# EasyEDA Pro project 电流采样.eprj

# Schematic Schematic1
Board Name: Board1; Create Date: 2025-05-20; Page Name: P1; Project Name: 霍尔; Schematic Name: Schematic1; Update Date: 2025-06-05; Company: 嘉立创EDA; Page Size: A4; Version: V1.0
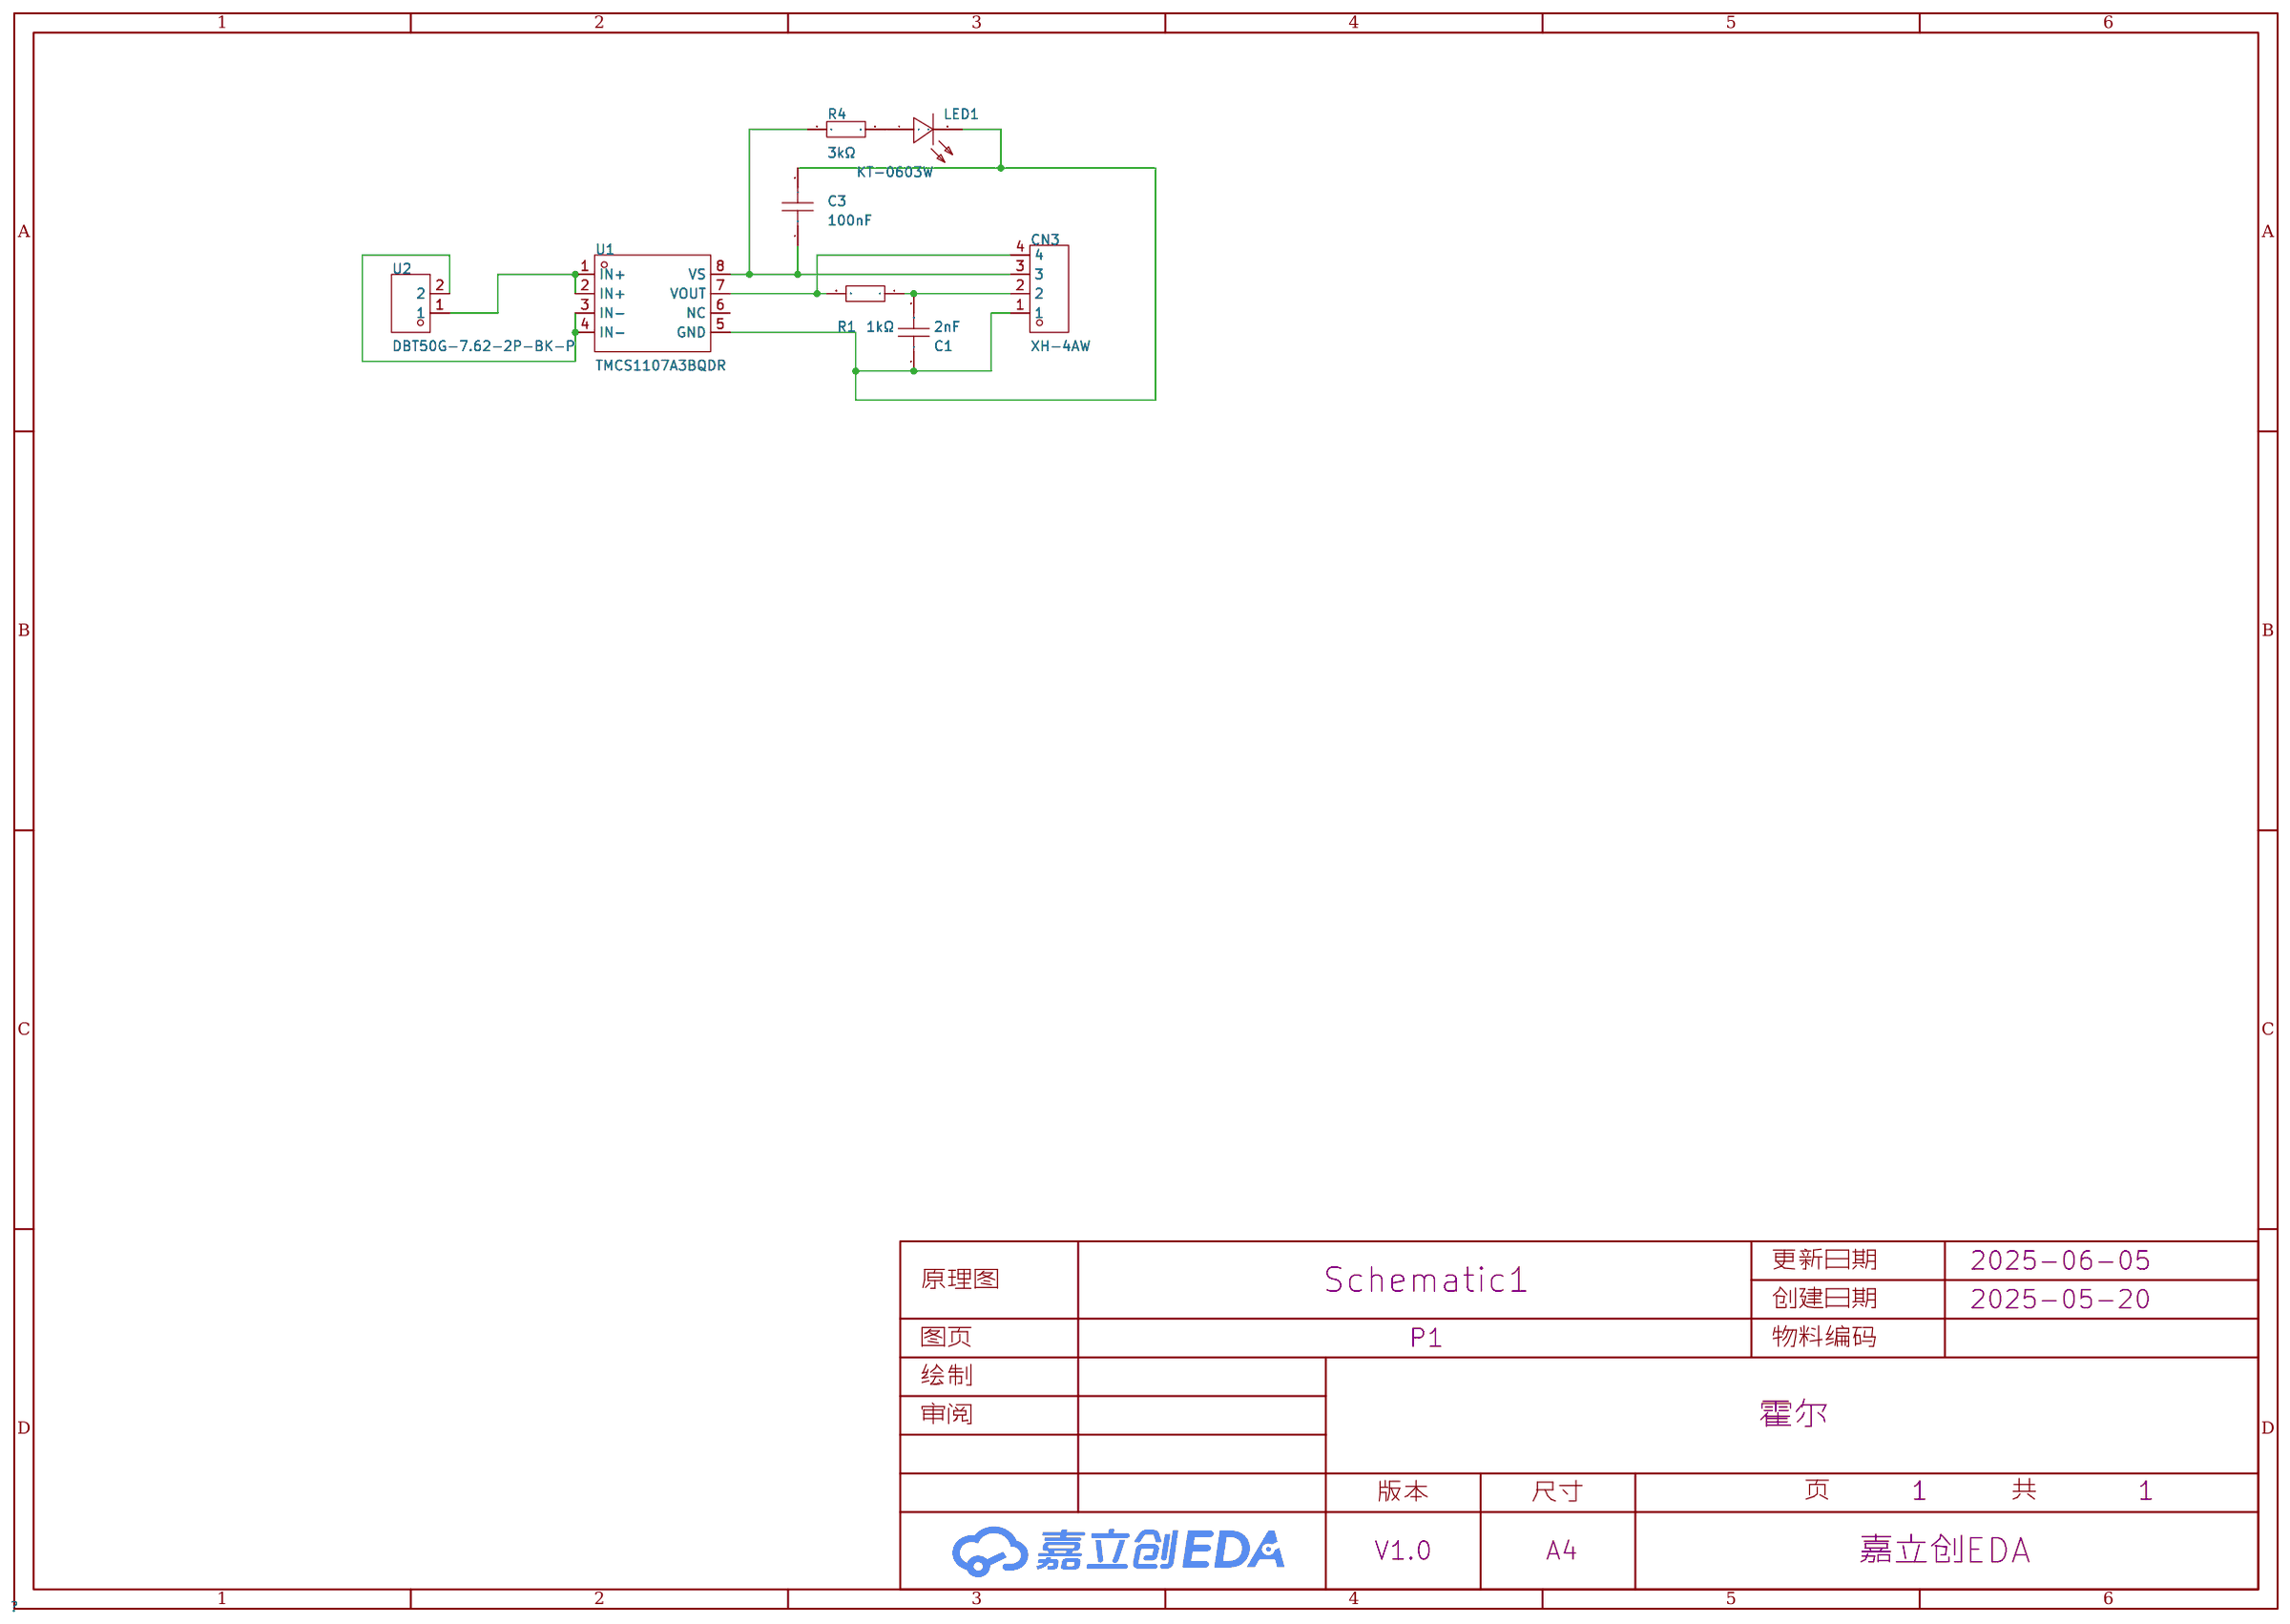
[diagram p0: schematic sheet]

## Parts
C1  2nF  [C0603]
C3  100nF  [C0603]
CN3  XH-4AW  [CONN-TH_XH-4AW]
LED1  KT-0603W  [LED0603-R-RD_WHITE]
R1  1kΩ  [R0603]
R4  3kΩ  [R0603]
U1  TMCS1107A3BQDR  [SOIC-8_L4.9-W3.9-P1.27-LS6.0-BL]
U2  DBT50G-7.62-2P-BK-P  [CONN-TH_2P-P7.62_L15.2-W16.7-EX4.2]

## Library data of the parts
C1 = CC0603KRX7R9BB202: LCSC Part Name: 2nF ±10% 50V; Supplier Part: C282245; Manufacturer: YAGEO(国巨); Supplier Footprint: 0603; JLCPCB Part Class: 扩展库; Datasheet: https://atta.szlcsc.com/upload/public/pdf/source/20181008/C309510_22F155564471FAF6A489F7D68F34234E.pdf; Supplier: LCSC; Tolerance: ±10%; Voltage Rated: 50V; Temperature Coefficient: X7R
C3 = CC0603KPX7R8BB104: LCSC Part Name: 100nF ±10% 25V; Supplier Part: C1853266; Manufacturer: YAGEO(国巨); Supplier Footprint: 0603; JLCPCB Part Class: 扩展库; Datasheet: https://atta.szlcsc.com/upload/public/pdf/source/20210519/C1853266_B039A01508EBB3ABAC609DE3C0C37EBA.pdf; Supplier: LCSC; Tolerance: ±10%; Voltage Rating: 25V; Temperature Coefficient: X7R
CN3 = XH-4AW: 插针结构:1x4P;间距:2.54mm;安装方式:弯插;参考系列:XH;总PIN数:4P;排数:1;每排PIN数:4;行距:-;额定电流:3A;触头材质:黄铜;触头镀层:锡;工作温度范围:-25℃~+85℃;; LCSC Part Name: 1x4P 间距:2.54mm 弯插 系列:XH; Supplier Part: C2908613; Manufacturer: HCTL(华灿天禄); Supplier Footprint: 弯插,P=2.5mm; JLCPCB Part Class: Extended Part; Datasheet: https://atta.szlcsc.com/upload/public/pdf/source/20230711/B565BAF3B11666EF6B81B3605408F2BD.pdf; Supplier: LCSC; Pins Structure: 1x4P; Pitch: 2.54mm; Mounting Style: 弯插; Reference Series: XH; Number of Pins: 4P; Number of Rows: 1; Number of PINs Per Row: 4; Current Rating (Max): 3A; Contact Material: 黄铜; Contact Plating: 锡; Operating Temperature Range: -25℃~+85℃
LED1 = KT-0603W: 发光颜色:白色;; LCSC Part Name: 0603 白灯 高亮; Supplier Part: C2290; Manufacturer: KENTO; Supplier Footprint: 0603; JLCPCB Part Class: 基础库; Datasheet: https://atta.szlcsc.com/upload/public/pdf/source/20221101/4C23D5C85BA051E44A00B833D0A41468.pdf; Supplier: LCSC; Emitted Color: 白色
R1 = 0603WAF1001T5E: LCSC Part Name: 1kΩ ±1% 100mW 厚膜电阻; Supplier Part: C21190; Manufacturer: UNI-ROYAL(厚声); Supplier Footprint: 0603; JLCPCB Part Class: 基础库; Datasheet: https://atta.szlcsc.com/upload/public/pdf/source/20200306/C422600_1E6D84923E4A46A82E41ADD87F860B5C.pdf; Supplier: LCSC; Type: 厚膜电阻; Tolerance: ±1%; Power(Watts): 100mW; Overload Voltage (Max): 75V; Temperature Coefficient: ±100ppm/℃; Operating Temperature Range: -55℃~+155℃
R4 = ARG03FTC3001: 电阻类型:薄膜电阻;阻值:3kΩ;精度:±1%;功率:100mW;最大工作电压:75V;温度系数:±25ppm/℃;; LCSC Part Name: 薄膜电阻 3kΩ ±1% 100mW; Supplier Part: C218002; Manufacturer: Viking(光颉); Supplier Footprint: 0603; JLCPCB Part Class: 扩展库; Datasheet: https://atta.szlcsc.com/upload/public/pdf/source/20190816/C412422_E173BA386C6DD8245B6A88358EF9877A.pdf; Supplier: LCSC; Type: 薄膜电阻; Tolerance: ±1%; Power(Watts): 100mW; Overload Voltage (Max): 75V; Temperature Coefficient: ±25ppm/℃; Operating Temperature Range: -55℃~+155℃
U1 = TMCS1107A3BQDR: Supplier Part: C3684250; Manufacturer: TI(德州仪器); Supplier Footprint: SOIC-8; JLCPCB Part Class: 扩展库; Datasheet: https://www.ti.com/cn/lit/gpn/tmcs1107; Supplier: LCSC; Supply Voltage: 3V~5.5V; Sensitivity: 200mV/A; Operating Temperature: -40℃~+125℃
U2 = DBT50G-7.62-2P-BK-P: LCSC Part Name: 7.62mm 1x2P 每排P数:2 排数:1 直针 边脚; Supplier Part: C496127; Manufacturer: DORABO(地博电气); Supplier Footprint: 插件,P=7.62mm; JLCPCB Part Class: 扩展库; Datasheet: https://atta.szlcsc.com/upload/public/pdf/source/20230321/5EF6A0D07A73B1490602C5D26A4C0507.pdf; Supplier: LCSC; Barrier Type: 带盖板; Pitch: 7.62mm; Structure: 1x2P; Mounting Style: 直针; Pin Location: 边脚; Number of Pins: 2P; Number of Rows: 1; Current Rating (Max): 20A; Voltage Rating (Max): 300V; Wire Gauge - AWG: 12~22; Operating Temperature Range: -40℃~+105℃; Color: 黑色; Number of PINs Per Row: 2

## Nets
$1N314: U1.1(IN+) U1.2(IN+) U2.1
$1N322: U1.3(IN-) U1.4(IN-) U2.2
$1N403: CN3.4 R1.2 U1.7(VOUT)
$1N475: C1.2 CN3.2 R1.1
$1N479: C1.1 C3.2 CN3.1 LED1.2(K) U1.5(GND)
$1N485: C3.1 CN3.3 R4.1 U1.8(VS)
$1N1198: LED1.1(A) R4.2

Not connected (* = marked no-connect by the designer): U1 6(NC)

# Board PCB1
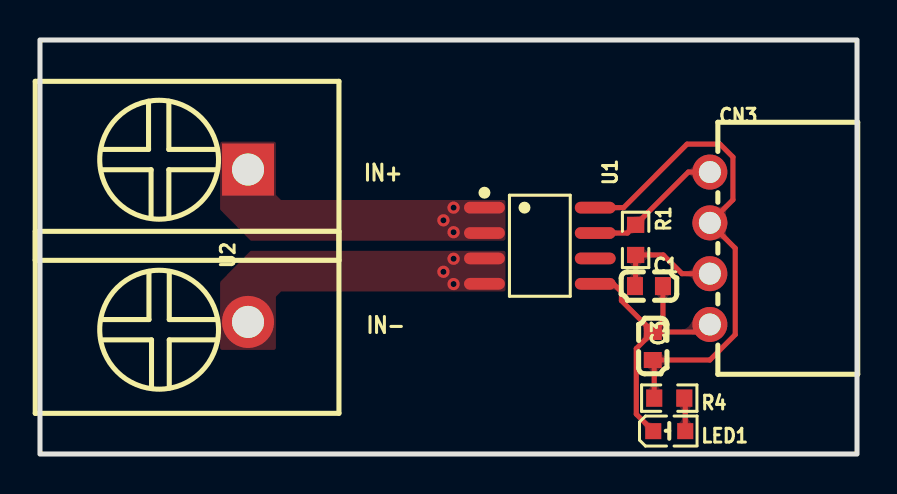
[diagram p1: board, top side]
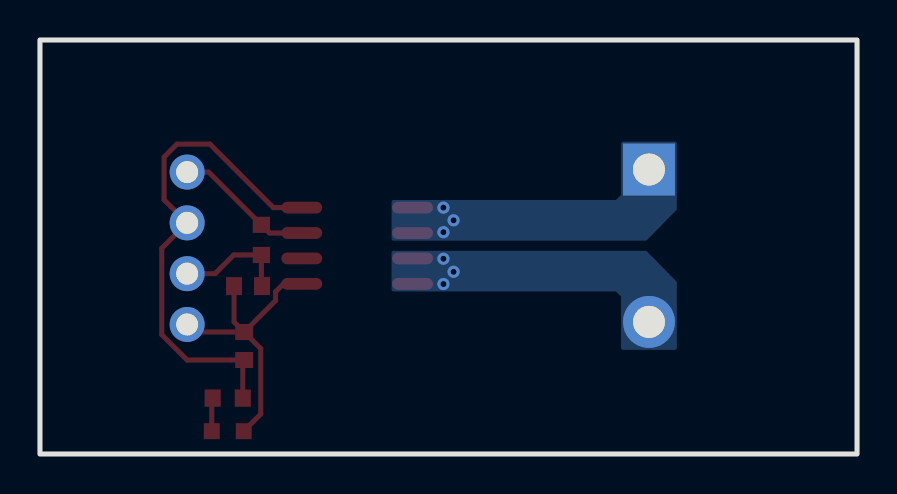
[diagram p2: board, bottom side, seen from below]

Outline 40.89 x 20.7 mm; copper layers: Top Layer, Bottom Layer. Coordinates in mm from the lower left corner of the outline.
Outline path: rectangle 0,20.7 40.89,0
Stack: Top Layer 0.035mm / Dielectric1 1.51mm FR4 er 4.5 / Bottom Layer 0.035mm

## Design rules (mm)
template: 自定义配置
spacing copperThickness1oz (default): track to track 0.102, other pairs 0.152 to 0.3
spacing copperThickness2oz: track to track 0.203, other pairs 0.152 to 0.3
track width copperThickness1oz (default): min 0.127, default 0.254, max 2.54
track width copperThickness2oz: min 0.203, default 0.254, max 2.54
differential pair differentialPair (default): width min 0.127, default 0.254, max 2.54; gap min 0.152, default 0.152
via viaSize (default): diameter min 0.5, default 0.61, max 10; hole min 0.3, default 0.305, max 6.3
net $1N314 uses copperRegion1
net $1N322 uses copperRegion1

## Placement (name value [footprint] x y rotation side)
C1  2nF  [C0603]  30.48 8.4 180 top
C3  100nF  [C0603]  30.67 5.4 90 top
CN3  XH-4AW  [CONN-TH_XH-4AW]  33.53 10.29 90 top
LED1  KT-0603W  [LED0603-R-RD_WHITE]  31.5 1.14 0 top
R1  1kΩ  [R0603]  29.81 10.71 90 top
R4  3kΩ  [R0603]  31.5 2.79 0 top
U1  TMCS1107A3BQDR  [SOIC-8_L4.9-W3.9-P1.27-LS6.0-BL]  25.02 10.41 270 top
U2  DBT50G-7.62-2P-BK-P  [CONN-TH_2P-P7.62_L15.2-W16.7-EX4.2]  10.41 10.41 270 top

## Footprints (pads in the part's own frame, mm; a bottom-side part is the same pattern mirrored in y, then rotated)
C0603
  rect 0.8x0.9 smd: 1(-0.7,0) 2(0.7,0)
CONN-TH_2P-P7.62_L15.2-W16.7-EX4.2
  rect 2.6x2.6 hole 1.6: 1(-3.81,0)
  round 2.6 hole 1.6: 2(3.81,0)
CONN-TH_XH-4AW
  round 1.75 hole 1.1: 1(-3.81,0) 2(-1.27,0) 3(1.27,0) 4(3.81,0)
LED0603-R-RD_WHITE
  rect 0.8x0.8 smd: 1(0.8,0) 2(-0.8,0)
R0603
  rect 0.806x0.864 smd: 1(-0.753,0) 2(0.753,0)
SOIC-8_L4.9-W3.9-P1.27-LS6.0-BL
  oval 0.588x2.045 smd: 1(-1.905,-2.772) 2(-0.635,-2.772) 3(0.635,-2.772) 4(1.905,-2.772) 5(1.905,2.772) 6(0.635,2.772) 7(-0.635,2.772) 8(-1.905,2.772)

## Nets
As in the schematic.

Pads without a net: U1 6

## Via types
v1: diameter 0.61, hole 0.305, Top Layer to Bottom Layer, 6 vias

## Routing (per net, layer and track width the routed paths; a pad name or vN(x,y) marks a point on that pad's centre or on a via; arc(x,y) is an arc through that point)
$1N314:
  vias: v1(20.19,11.68) v1(20.7,12.32) v1(20.7,11.09)
$1N322:
  vias: v1(20.19,9.11) v1(20.7,9.76) v1(20.7,8.5)
$1N403: length 7
  Top Layer w0.254: U1.7 29.4,11.05 R1.2 32.45,14.1 CN3.4
$1N475: length 5.7
  Top Layer w0.254: CN3.2 32.13,9.02 31.2,9.95 R1.1 29.81,8.43 C1.2
$1N479: length 15.3
  Top Layer w0.254: C3.2 31.18,6.61 C1.1 ; C3.2 33.15,6.1 CN3.1 ; C3.2 29.85,5.27 29.85,1.99 LED1.2 ; C3.2 29.1,7.67 29.1,8.11 28.7,8.51 U1.5
$1N485: length 24.9
  Top Layer w0.254: R4.1 30.74,4.63 C3.1 33.53,4.7 34.8,5.97 34.8,10.29 CN3.3 34.68,12.71 34.68,14.85 34.04,15.49 32.39,15.49 29.21,12.32 U1.8
$1N1198: length 1.7
  Top Layer w0.254: LED1.1 32.3,2.75 R4.2

## Copper pours and planes (outline as drawn; the poured copper is in the pictures)
$1N314 on Top Layer: 9.02,15.62 11.81,15.62 11.81,12.95 12.07,12.7 23.3,12.7 23.3,10.67 10.54,10.67 9.02,12.22
$1N314 on Bottom Layer: 9.02,15.62 11.81,15.62 11.81,12.95 12.07,12.7 23.3,12.7 23.3,10.67 10.54,10.67 9.02,12.22
$1N322 on Top Layer: 9.02,5.21 11.81,5.21 11.81,7.87 12.07,8.13 23.3,8.13 23.3,10.16 10.54,10.16 9.02,8.61
$1N322 on Bottom Layer: 9.02,5.21 11.81,5.21 11.81,7.87 12.07,8.13 23.3,8.13 23.3,10.16 10.54,10.16 9.02,8.61

Small or netless copper shapes (teardrops, artwork), in the pictures only: 24 on Top Layer

## Text on the board
Top Silkscreen Layer: IN+ | IN-
